# EAGLE design Turntable (EAGLE 9.4.0)
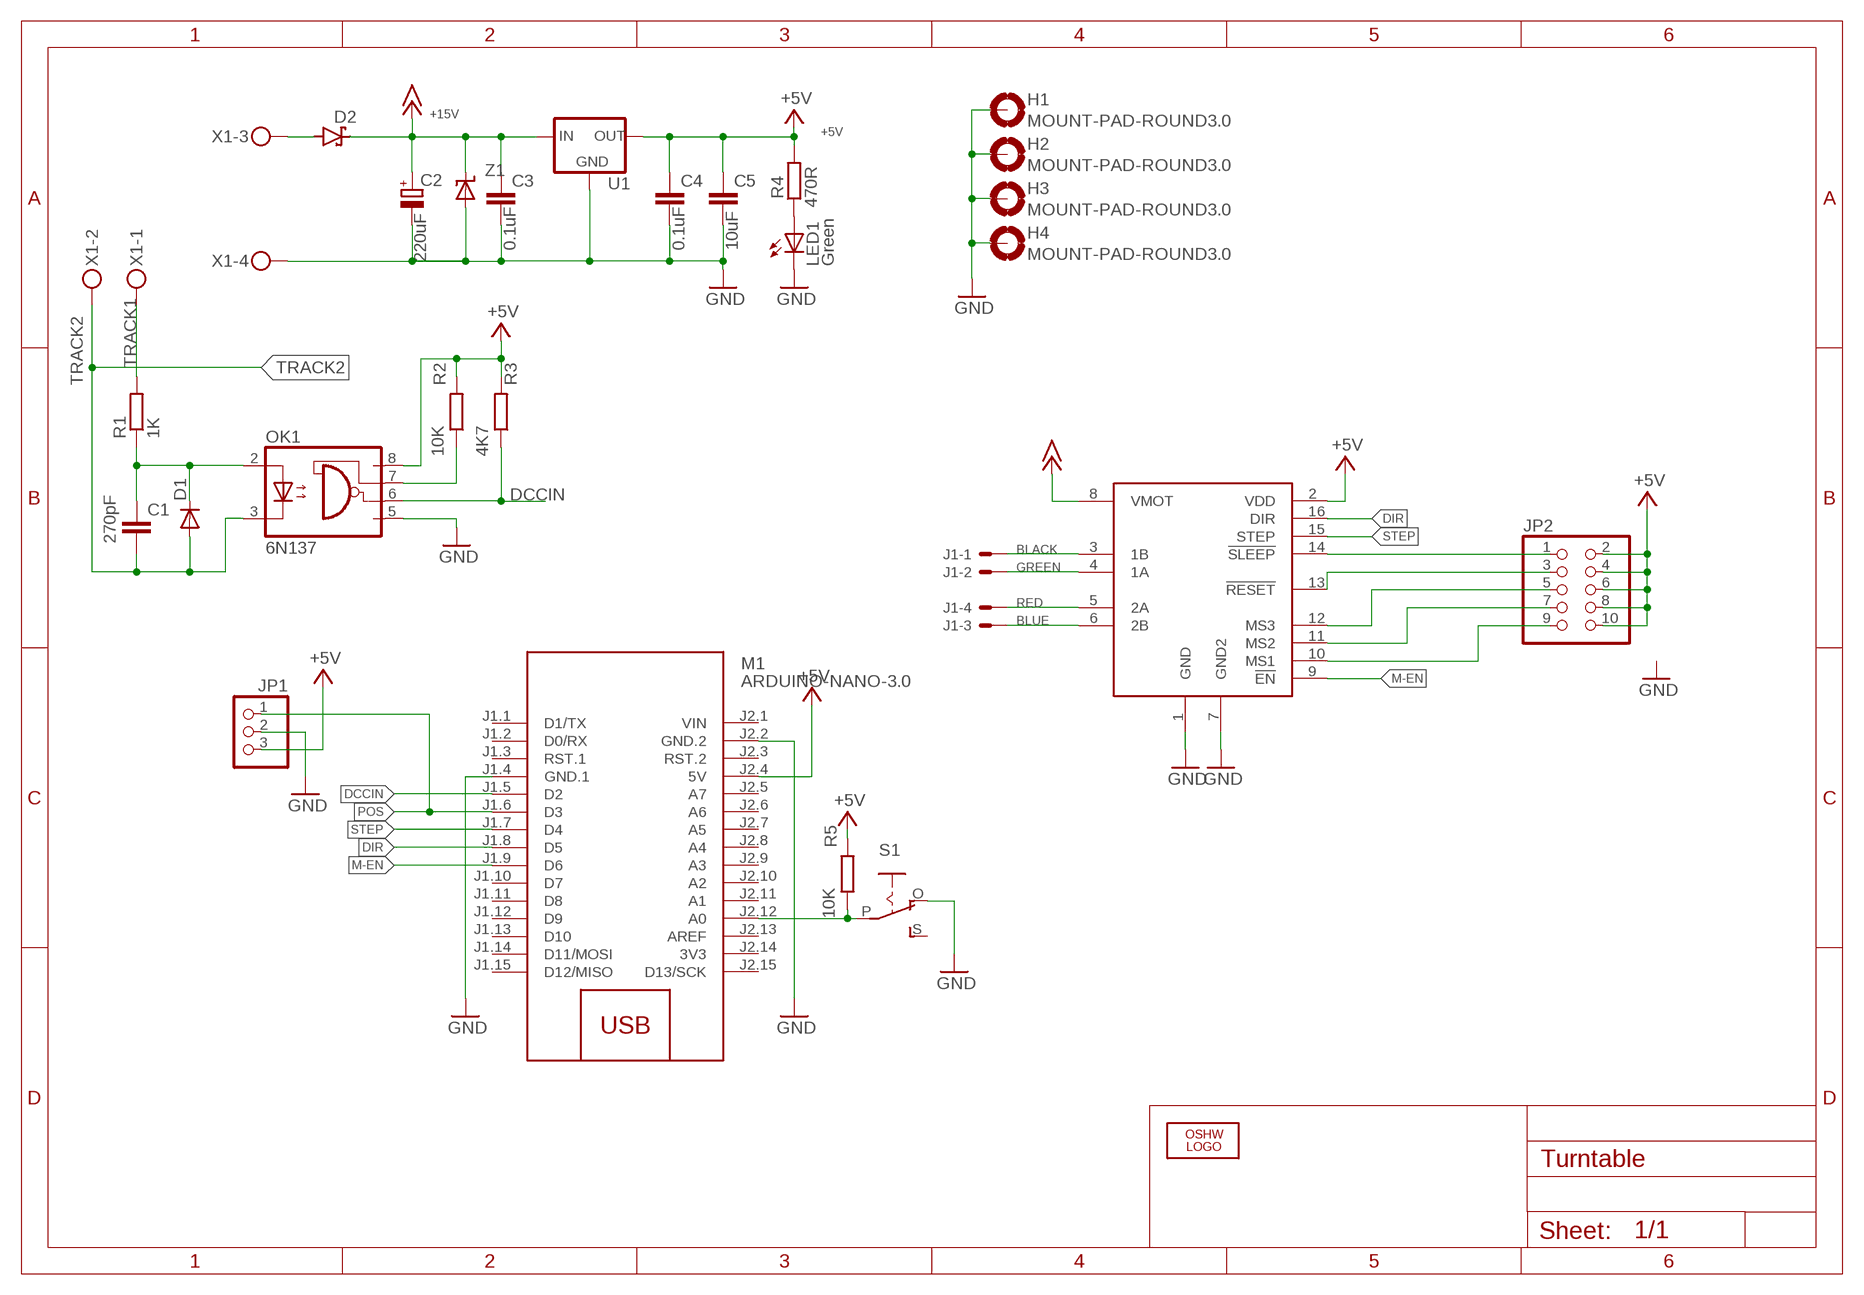
[diagram p0: schematic, sheet 1]

## Parts
C1  270pF  C-EUC0805  [C0805]
C2  220uF  CPOL-EUE7.5-16  [E7,5-16]
C3  0.1uF  C-EUC0805  [C0805]
C4  0.1uF  C-EUC0805  [C0805]
C5  10uF  C-EUC0805  [C0805]
D1  CGRM4002-G  [SOD-123_MINI-SMA]
D2  SCHOTTKY-DIODESMD  [SMB]
H1  MOUNT-PAD-ROUND3.0  [3,0-PAD]
H2  MOUNT-PAD-ROUND3.0  [3,0-PAD]
H3  MOUNT-PAD-ROUND3.0  [3,0-PAD]
H4  MOUNT-PAD-ROUND3.0  [3,0-PAD]
J1  HEADER4  [HEADER4]
JP1  PINHD-1X3  [1X03]
JP2  PINHD-2X5  [2X05]
LED1  Green  LED3MM  [LED3MM]
LOGO1  OSHW_LOGO_6MILX0200-NT  [OSHW_6X200_NOTEXT]
M1  ARDUINO-NANO-3.0  [ARDUINO-NANO-3.0]
OK1  6N137  [DIL08]
R1  1K  R-EU_R0805  [R0805]
R2  10K  R-EU_R0805  [R0805]
R3  4K7  R-EU_R0805  [R0805]
R4  470R  R-EU_R0805  [R0805]
R5  10K  R-EU_R0805  [R0805]
S1  EG1218S  [EG1218]
U1  V_REG_78XX-TO-220  [TO-220-ALT]
U2  A4988  [POLOLUA4988]
X1  MKDSN1,5/4-5,08  [MKDSN1,5/4-5,08]
Z1  TRANSZORB  [SMB]

## Nets
+5V: C4.1 C5.1 JP1.3 JP2.2 JP2.4 JP2.6 JP2.8 JP2.10 M1.J2.4(5V) OK1.8(VCC) R2.2 R3.2 R4.2 R5.2 U1.OUT U2.2(VDD)
+15V: C2.+ C3.1 D2.C U1.IN U2.8(VMOT) Z1.1(C)
BLACK: J1.1 U2.3(1B)
BLUE: J1.3 U2.6(2B)
DCCIN: M1.J1.5(D2) OK1.6(VO) R3.1
DIR: M1.J1.8(D5) U2.16(DIR)
GND: C2.- C3.2 C4.2 C5.2 H1.B3,0(MOUNT) H2.B3,0(MOUNT) H3.B3,0(MOUNT) H4.B3,0(MOUNT) JP1.2 LED1.K(C) M1.J1.4(GND.1) M1.J2.2(GND.2) OK1.5(GND) S1.O U1.GND U2.1(GND) U2.7(GND2) X1.4 Z1.2(A)
GREEN: J1.2 U2.4(1A)
LEARN: M1.J2.12(A0) R5.1 S1.P
M-EN: M1.J1.9(D6) U2.9(!EN)
N$1: D2.A X1.3
N$2: C1.1 D1.C OK1.2(A) R1.1
N$4: OK1.7(VE) R2.1
N$11: JP2.9 U2.10(MS1)
N$12: JP2.1 U2.14(!SLEEP)
N$13: JP2.3 U2.13(!RESET)
N$14: JP2.5 U2.12(MS3)
N$15: JP2.7 U2.11(MS2)
N$42: LED1.A R4.1
POS: JP1.1 M1.J1.6(D3)
RED: J1.4 U2.5(2A)
STEP: M1.J1.7(D4) U2.15(STEP)
TRACK1: R1.2 X1.1
TRACK2: C1.2 D1.A OK1.3(C) X1.2
Unconnected: M1.J1.1(D1/TX) M1.J1.2(D0/RX) M1.J1.3(RST.1) M1.J1.10(D7) M1.J1.11(D8) M1.J1.12(D9) M1.J1.13(D10) M1.J1.14(D11/MOSI) M1.J1.15(D12/MISO) M1.J2.3(RST.2) M1.J2.5(A7) M1.J2.6(A6) M1.J2.7(A5) M1.J2.8(A4) M1.J2.9(A3) M1.J2.10(A2) M1.J2.11(A1) M1.J2.13(AREF) M1.J2.15(D13/SCK) S1.S

## Power pins joined to a net without a drawn wire
3V3: M1.J2.14(3V3)
VIN: M1.J2.1(VIN)

## Library data of the parts
C1 C3-C5 = rcl:C-EU: CAPACITOR, European symbol; SPICEPREFIX: C
C2 = rcl:CPOL-EU: POLARIZED CAPACITOR, European symbol; SPICEPREFIX: C
D1 = diode:CGRM400*-G: Molded plasitc,JEDEC SOD-123/Mini SMA Source: Comchip CGRM4001-G.pdf
D2 = diode:SCHOTTKY-DIODE: Schottky Diode
H1-H4 = holes:MOUNT-PAD-ROUND: MOUNTING PAD, round
J1 = GJR:HEADER4: 4 way 0.1 inch Header
JP1 = adafruit:PINHD-1X3: PIN HEADER
JP2 = pinhead:PINHD-2X5: PIN HEADER
LED1 = adafruit:LED: LED OSRAM: - CHIPLED LG R971, LG N971, LY N971, LG Q971, LY Q971, LO R971, LY R971 LH N974, LH R974 LS Q976, LO Q976, LY Q976 LO Q996 - Hyper CHIPLED LW Q18S LB Q993, LB Q99A, LB R99A - SideLED LS A670, LO A670, LY A670, LG A670, LP A670 LB A673, LV A673, LT A673, LW A673 LH A674 LY A675 LS A676, LA A676, LO A676, LY A676, LW A676 LS A679, LY A679, LG A679 - Hyper Micro SIDELED® LS Y876, LA Y876, LO Y876, LY Y876 LT Y87S - SmartLED LW L88C, LW L88S LB L89C, LB L89S, LG L890 LS L89K, LO L89K, LY L89K LS L896, LA L896, LO L896, LY L896 - TOPLED LS T670, LO T670, LY T670, LG T670, LP T670 LSG T670, LSP T670, LSY T670, LOP T670, LYG T670 LG T671, LOG T671, LSG T671 LB T673, LV T673, LT T673, LW T673 LH T674 LS T676, LA T676, LO T676, LY T676, LB T676, LH T676, LSB T676, LW T676 LB T67C, LV T67C, LT T67C, LS T67K, LO T67K, LY T67K, LW E67C LS E67B, LA E67B, LO E67B, LY E67B, LB E67C, LV E67C, LT E67C LW T67C LS T679, LY T679, LG T679 LS T770, LO T770, LY T770, LG T770, LP T770 LB T773, LV T773, LT T773, LW T773 LH T774 LS E675, LA E675, LY E675, LS T675 LS T776, LA T776, LO T776, LY T776, LB T776 LHGB T686 LT T68C, LB T68C - Hyper Mini TOPLED® LB M676 - Mini TOPLED Santana® LG M470 LS M47K, LO M47K, LY M47K Source: http://www.osram.convergy.de/
LOGO1 = ohw-logo:OSHW_LOGO_6MIL
M1 = diy-modules:ARDUINO-NANO-3.0: Arduino Nano 3.0 and compatible devices More details available here: https://www.arduino.cc/en/Main/ArduinoBoardNano Click here to find device on ebay.com <http://www.ebay.com/sch/arduino+nano>
OK1 = optocoupler:6N137: MOTOROLA OPTO COUPLER; MPN: 6N137; OC_FARNELL: 1328376; OC_NEWARK: 52M1895
R1-R5 = rcl:R-EU_: RESISTOR, European symbol
S1 = adafruit:EG1218: SLIDING SWITCH 0.1" spacing through hole, vertical SPDT slide switch http://www.ladyada.net/library/pcb/eaglelibrary.html
U1 = SparkFun-IC-Power:V_REG_78XX: Voltage Regulator Standard 78xx regulator. IGO (Input Ground Output). Spark Fun Electronics SKU : COM-00107; PROD_ID: VREG-08450; SF_ID: COM-00107
U2 = GJR:A4988: Pololu A4988 Stepper Module
X1 = con-phoenix-508:MKDSN1,5/4-5,08: MKDSN 1,5/ 4-5,08 Printklemme Nennstrom: 13,5 A Nennspannung: 250 V Rastermaß: 5,08 mm Polzahl: 4 Anschlussart: Schraubanschluss Montage: Löten Anschlussrichtung Leiter/Platine: 0 ° Artikelnummer: 1729144 Source: http://eshop.phoenixcontact.com .. 1729144.pdf; MPN: SMKDSN1,5/4-5,08; OC_FARNELL: 1792905; OC_NEWARK: 70R0300
Z1 = GJR:TRANSZORB; VOLTAGE: 15V

## Board
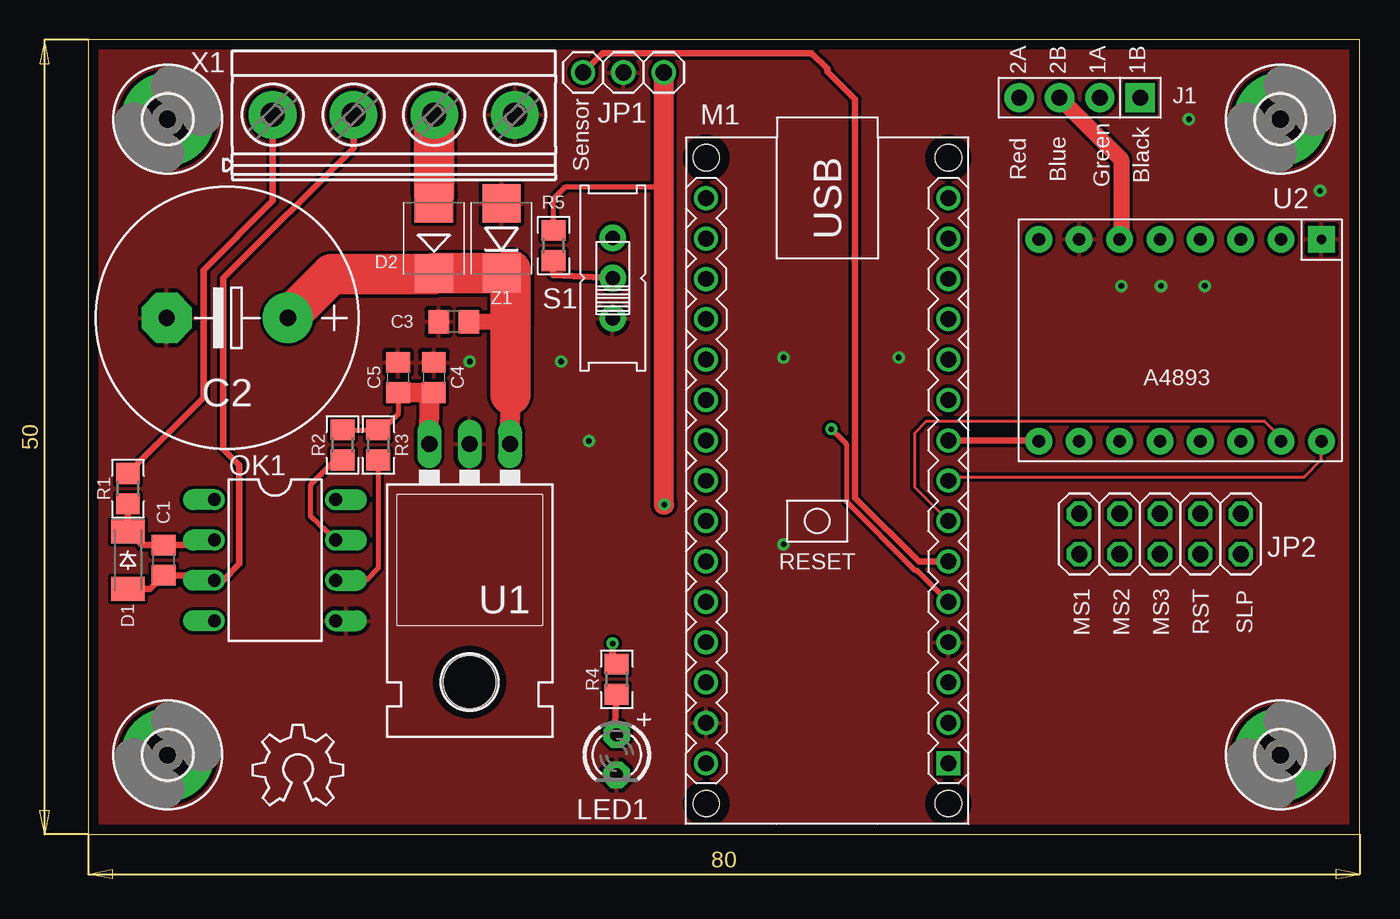
[diagram p1: board, top side]
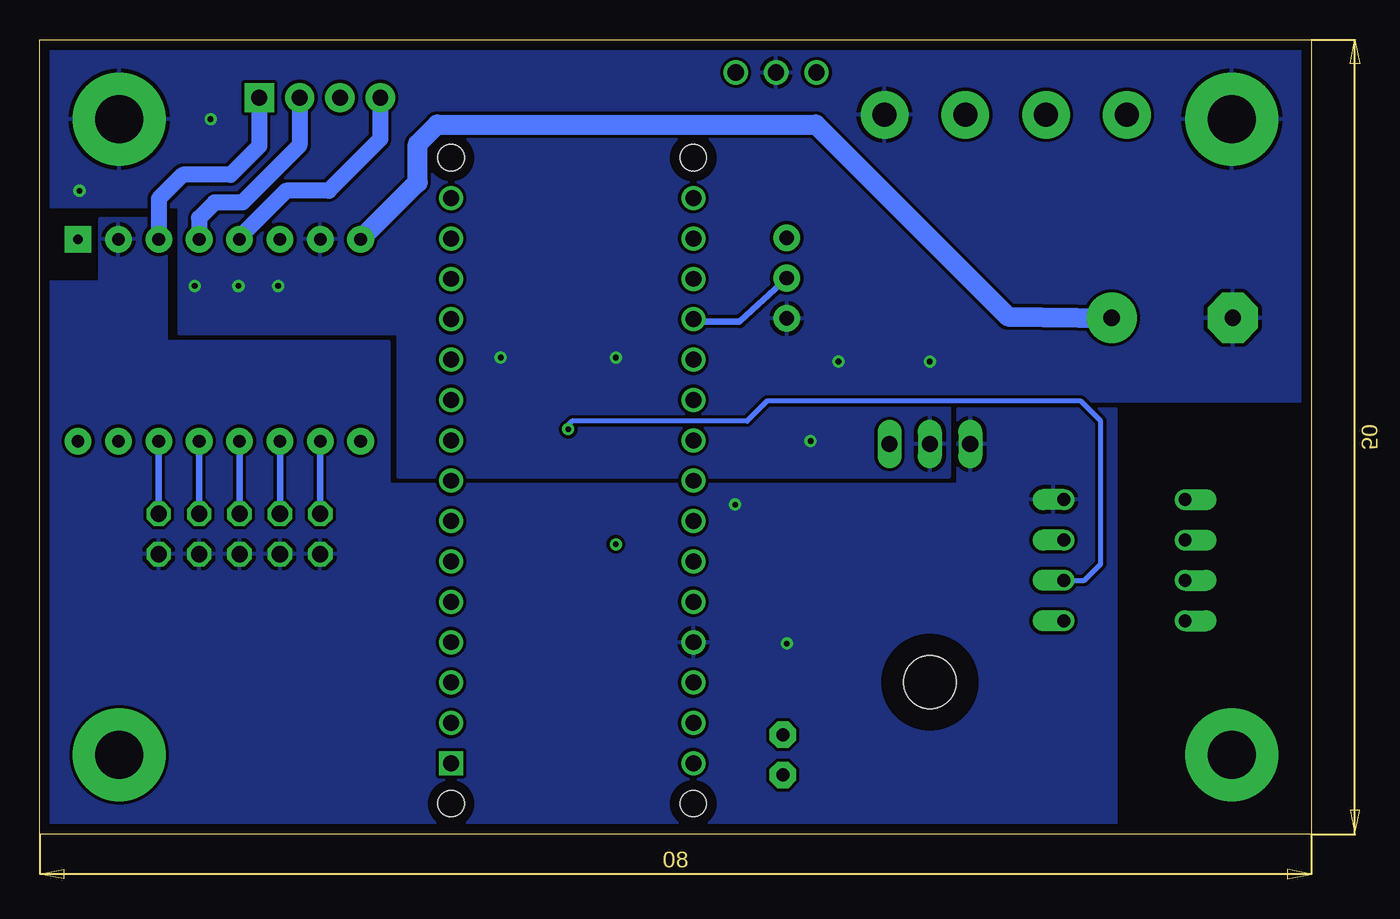
[diagram p2: board, bottom side, seen from below]

Size 80 x 50 mm. Coordinates in mm from the lower left corner, seen from the top.
Outline: 0,0 80,0 80,50 0,50 0,0
Copper layers (1*16): Top 0.035mm / dielectric 1.5mm / Bottom 0.035mm
Design rules "default *": minimum track width 8mil, minimum drill 0.3mm, track to track 8mil, track to pad 8mil, pad to pad 8mil, via to via 8mil, smd to smd 8mil, copper to edge 25mil, drill to drill 8mil, minimum pad ring 10mil, minimum via ring 8mil, stop-mask expansion 4mil, vias tented up to drill 0mil, thermal gap 10mil

### Footprints (pad centres in the part's own frame; a part is rotated, then mirrored left to right if it is on the bottom)
C0805 = smd 1.3 x 1.5: 1 -0.95,0; 2 0.95,0
E7,5-16 = drill 1.016 pad 3.15: + -3.81,0 | drill 1.016 pad 3.15 octagon: - 3.81,0
SOD-123_MINI-SMA = smd 1.5 x 2.1: A 1.8,0; C -1.8,0
SMB = smd 2.4 x 2.4: A 2.2,0; C -2.2,0
3,0-PAD = drill 3 pad 5.842: B3,0 0,0
HEADER4 = drill 1 pad 1.85 square: 1 0,0 | drill 1 pad 1.85: 2 0,-2.54; 3 0,-5.08; 4 0,-7.62
1X03 = drill 1.016: 1 -2.54,0; 2 0,0; 3 2.54,0
2X05 = drill 1.016 octagon: 1 -5.08,-1.27; 2 -5.08,1.27; 3 -2.54,-1.27; 4 -2.54,1.27; 5 0,-1.27; 6 0,1.27; 7 2.54,-1.27; 8 2.54,1.27; 9 5.08,-1.27; 10 5.08,1.27
LED3MM = drill 0.813 pad 1.676 octagon: A -1.27,0; K 1.27,0
ARDUINO-NANO-3.0 = drill 1 square: J1.1 17.78,7.62 | drill 1: J1.2 15.24,7.62; J1.3 12.7,7.62; J1.4 10.16,7.62; J1.5 7.62,7.62; J1.6 5.08,7.62; J1.7 2.54,7.62; J1.8 0,7.62; J1.9 -2.54,7.62; J1.10 -5.08,7.62; J1.11 -7.62,7.62; J1.12 -10.16,7.62; J1.13 -12.7,7.62; J1.14 -15.24,7.62; J1.15 -17.78,7.62; J2.1 17.78,-7.62; J2.2 15.24,-7.62; J2.3 12.7,-7.62; J2.4 10.16,-7.62; J2.5 7.62,-7.62; J2.6 5.08,-7.62; J2.7 2.54,-7.62; J2.8 0,-7.62; J2.9 -2.54,-7.62; J2.10 -5.08,-7.62; J2.11 -7.62,-7.62; J2.12 -10.16,-7.62; J2.13 -12.7,-7.62; J2.14 -15.24,-7.62; J2.15 -17.78,-7.62 | hole 1.651: -20.32,7.62; -20.32,-7.62; 20.32,-7.62; 20.32,7.62
DIL08 = drill 0.813 offset: 1 -3.81,-3.81; 2 -1.27,-3.81; 3 1.27,-3.81; 4 3.81,-3.81; 5 3.81,3.81; 6 1.27,3.81; 7 -1.27,3.81; 8 -3.81,3.81
R0805 = smd 1.3 x 1.5: 1 -0.95,0; 2 0.95,0
EG1218 = drill 0.9 pad 1.676: O -2.54,0; P 0,0; S 2.54,0
TO-220-ALT = drill 1.016 long: GND 0,-3.81; IN -2.54,-3.81; OUT 2.54,-3.81 | hole 3.302: 0,11.176
POLOLUA4988 = drill 0.6 pad 1.676 square: 1 -6.35,8.89 | drill 0.8 pad 1.676: 2 -6.35,6.35; 3 -6.35,3.81; 4 -6.35,1.27; 5 -6.35,-1.27; 6 -6.35,-3.81; 7 -6.35,-6.35; 8 -6.35,-8.89; 9 6.35,-8.89; 10 6.35,-6.35; 11 6.35,-3.81; 12 6.35,-1.27; 13 6.35,1.27; 14 6.35,3.81; 15 6.35,6.35; 16 6.35,8.89
MKDSN1,5/4-5,08 = drill 1.5 pad 3: 1 -7.641,0.025; 2 -2.561,0.025; 3 2.519,0.025; 4 7.599,0.025
SMB' = smd 2.4 x 2.4: 1 -2.2,0; 2 2.2,0

### Placement (x,y rotation side)
C1  4.75,17.25 270 top
C2  8.75,32.5 180 top
C3  23,32.25 180 top
C4  21.75,28.75 90 top
C5  19.5,28.75 90 top
D1  2.5,17.25 270 top
D2  21.75,37.5 90 top
H1  75,45 0 top
H2  75,5 0 top
H3  5,5 0 top
H4  5,45 0 top
J1  66.19,46.35 270 top
JP1  33.67,47.94 0 top
JP2  67.43,18.9 180 top
LED1  33.25,5 270 top
LOGO1  10.36,1.82 0 top
M1  46.5,22.25 270 top
OK1  11.75,17.25 270 top
R1  2.5,21.75 90 top
R2  16,24.5 90 top
R3  18.25,24.5 90 top
R4  33.25,9.75 90 top
R5  29.28,37.05 90 top
S1  33,35 90 top
U1  24,20.75 180 top
U2  68.7,31.09 270 top
X1  19.25,45.25 0 top
Z1  [SMB']  26,37.5 90 top

### Tracks (layer width: path | path; a pad name or v marks a point on that pad's centre or on a via)
+5V  (via drill 0.35)
  Top 0.305: R2.2 R3.2 18.5,25.45 | 18.75,25.45 18.5,25.45 | C5.1 19.5,26.45 18.5,25.45 | R5.2 29.28,40 30.03,40.75 36.21,40.75
  Top 0.406: R4.2 33,10.74 v33,12 | 36.25,21 v36.25,20.75
  Top 1.27: U1.OUT 21.48,27.68 | 21.48,27.68 C4.1 | C5.1 21.34,27.82 21.48,27.68 | v36.25,20.75 36.21,20.75 36.21,40.75 JP1.3
  pour Bottom: 12.25,26.75 22.25,26.75 22.25,22 58,22 58,31 72,31 72,38.75 76.25,38.75 76.25,34.75 80,34.75 80,0 12.25,0
+15V
  Top 1.016: C3.1 26.28,32.25 26.56,31.97 | Z1.1 26.2,35.5 26.56,35.5
  Top 1.27: U1.IN 26.56,27.68
  Top 2.54: C2.+ 15.31,35.25 21.7,35.25 D2.C Z1.1 | 26.56,27.68 26.56,31.97 26.56,35.5
  Bottom 1.27: C2.+ 19.08,32.58 31.16,44.67 54.99,44.67 56.22,43.44 56.22,41.03 U2.8
BLACK
  Bottom 1.016: J1.1 66.19,43.31 68,41.5 71,41.5 72.51,39.99 U2.3
BLUE
  Top 1.016: J1.3 65,42.46 65,37.55 U2.6
DCCIN  (via drill 0.35)
  Top 0.305: R3.1 18.25,16.75 17.49,15.99 OK1.6 | v46.75,25.5 47.69,24.56 47.69,20.94 52.02,16.61 52.14,16.61 M1.J1.5
  Bottom 0.305: OK1.6 14.27,15.98 13.25,17 13.25,26 14.5,27.25 34.25,27.25 35.5,26 46.5,26 46.75,25.75 v46.75,25.5
DIR
  Top 0.203: M1.J1.8 54.37,22.5 76.5,22.5 77.59,23.59 U2.16
GND  (via drill 0.35)
  other vias: 31.5,24.75 43.75,30 51,30 77.5,40.5 69.25,45 24,29.75 29.75,29.75 43.75,18.25 65,34.5 67.5,34.5 70.25,34.5
  pour Top: 0,50 80,50 80,0 0,0
  pour Bottom: 0,50 80,50 80,39.5 71.25,39.5 71.25,31.5 57.5,31.5 57.5,22.5 22.75,22.5 22.75,27.25 0,27.25
GREEN
  Bottom 1.016: U2.4 69.97,38.78 69,39.75 67.25,39.75 63.65,43.35 J1.2
LEARN
  Top 0.406: R5.1 29.24,35.19 S1.P
  Bottom 0.406: S1.P 35.97,32.25 38.72,32.25 M1.J2.12
M-EN
  Top 0.406: M1.J1.9 59.76,24.79 U2.9
N$1
  Top 1.016: D2.A 21.77,39.72 21.77,40.25
  Top 2.54: 21.77,40.25 X1.3
N$2
  Top 0.406: OK1.2 7.51,18.2 C1.1 3.35,18.2 D1.C R1.1
N$4
  Top 0.305: OK1.7 14,19.99 14,22 15.55,23.55 R2.1
N$11
  Bottom 0.406: JP2.9 U2.10
N$12
  Bottom 0.406: JP2.1 U2.14
N$13
  Bottom 0.406: JP2.3 U2.13
N$14
  Bottom 0.406: JP2.5 U2.12
N$15
  Bottom 0.406: JP2.7 U2.11
N$42
  Top 0.406: LED1.A 33.12,6.35 R4.1
POS
  Top 0.406: M1.J1.6 52.25,17.17 48.25,21.17 48.25,46.25 46.5,48 46.5,48.16 45.5,49.16 32.35,49.16 JP1.1
RED
  Bottom 1.016: J1.4 58.57,43.75 61.82,40.5 64.5,40.5 67.43,37.57 U2.5
STEP
  Top 0.203: M1.J1.7 52,21.83 52,25.25 52.75,26 74,26 75.05,24.95 U2.15
TRACK1
  Top 0.406: X1.1 11.61,39.86 7.25,35.5 7.25,32.9 7.27,32.88 7.27,27.47 R1.2
TRACK2
  Top 0.406: X1.2 16.69,43.19 8.5,35 8.5,24.25 9.5,23.25 9.5,17 8.49,15.99 OK1.3 7.53,16.3 C1.2 3.9,15.45 D1.A

### Text on the board
tPlace: 2A | 2B | 1A | 1B | Sensor | Red | Blue | Green | Black | A4893 | MS1 | MS2 | MS3 | RST | SLP